# Altium schematic sheet iv_sensing.SchDoc: Triumvi - I/V Sensing
size Letter; Author: Ye-Sheng Kuo; Revision: 12; SheetNumber: 4; SheetTotal: 9
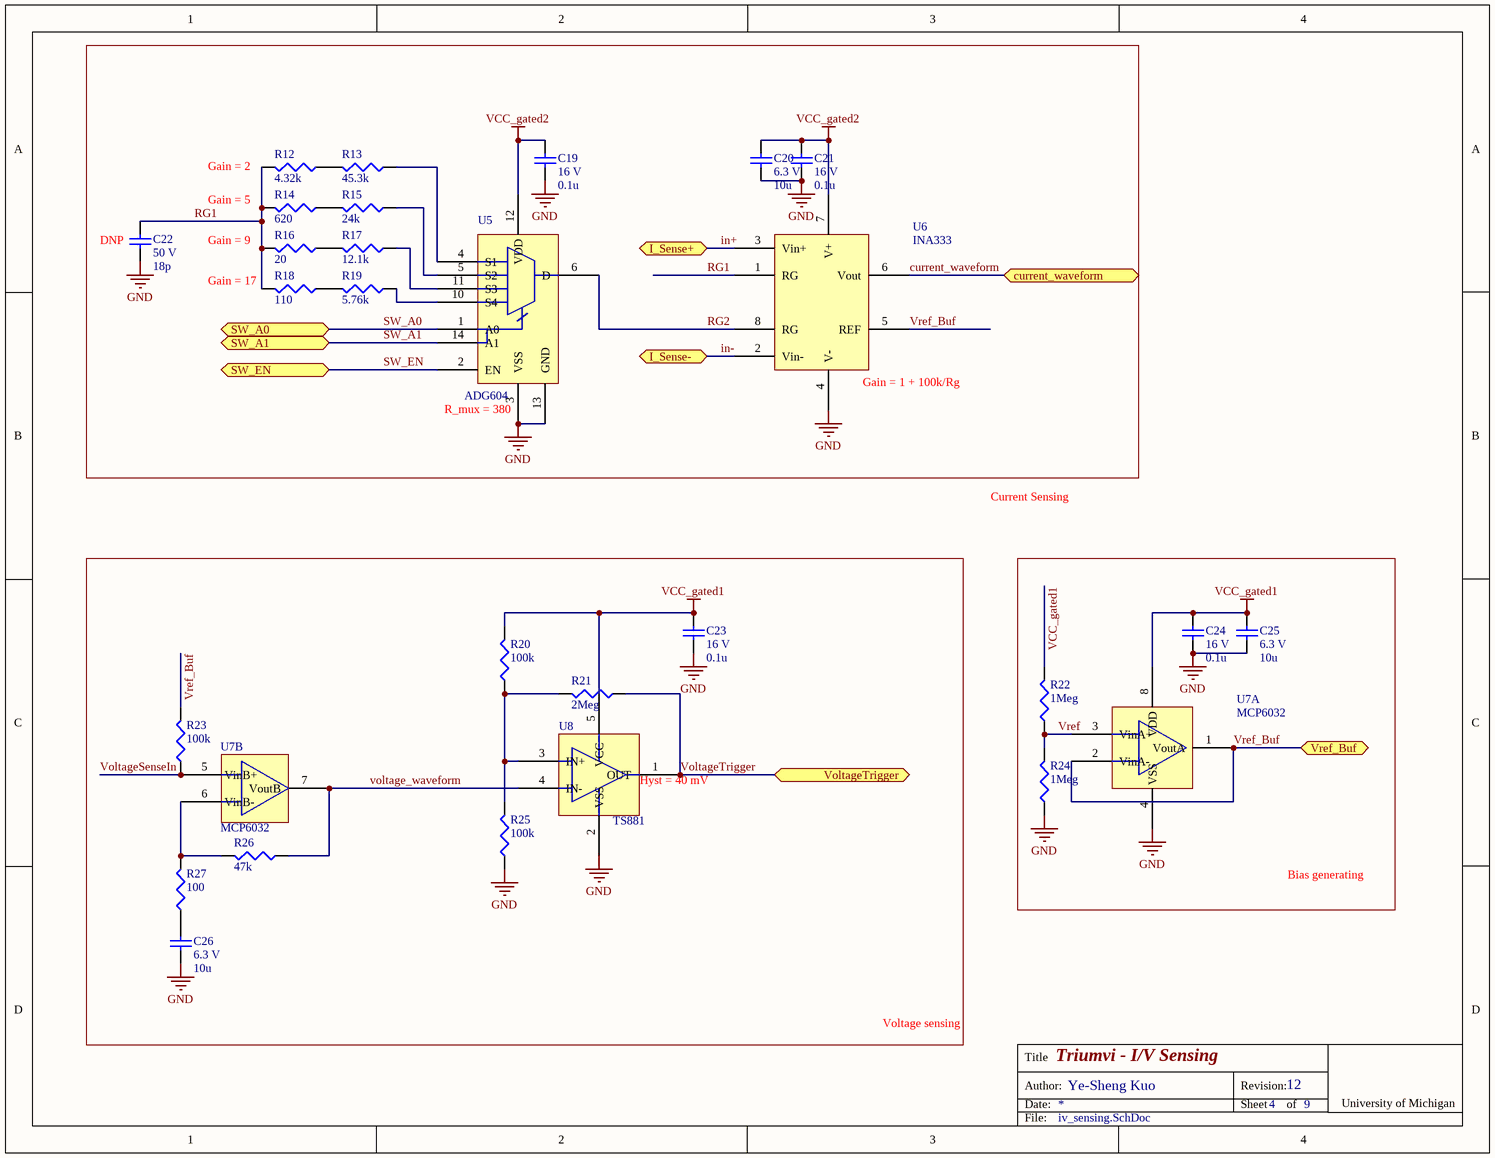
[diagram p0: iv_sensing.SchDoc]

## Parts
C19  voltage rated: 16 V  [0402]  (hidden comment: 0.1u)
C20  voltage rated: 6.3 V  [0603]  (hidden comment: 10u)
C21  voltage rated: 16 V  [0402]  (hidden comment: 0.1u)
C22  voltage rated: 50 V  [0402]  (hidden comment: 18p)
C23  voltage rated: 16 V  [0402]  (hidden comment: 0.1u)
C24  voltage rated: 16 V  [0402]  (hidden comment: 0.1u)
C25  voltage rated: 6.3 V  [0603]  (hidden comment: 10u)
C26  voltage rated: 6.3 V  [0603]  (hidden comment: 10u)
R12  4.32k  [0402]
R13  45.3k  [0402]
R14  620  [0402]
R15  24k  [0402]
R16  20  [0402]
R17  12.1k  [0402]
R18  110  [0402]
R19  5.76k  [0402]
R20  100k  [0402]
R21  2Meg  [0402]
R22  1Meg  [0402]
R23  100k  [0402]
R24  1Meg  [0402]
R25  100k  [0402]
R26  47k  [0402]
R27  100  [0402]
U5  ADG604  [TSSOP-14]
U6  INA333  [MSOP-8]
U7  MCP6032  [MSOP-8]  (parts A,B of 2)
U8  TS881  [SC70-5]

## Blocks framed on the sheet
Bias generating: C24 C25 R22 R24 U7

## Ports
current_waveform, I_Sense+, I_Sense-, SW_A0, SW_A1, SW_EN, VoltageTrigger, Vref_Buf

## Nets
GND: C19.2 C20.2 C21.2 C22.2 C23.2 C24.2 C25.2 C26.2 R24.2 R25.2 U5.3(VSS) U5.13(GND) U6.4(V-) U7.4(VSS) U8.2(VSS)
VCC_gated1: C23.1 C24.1 C25.1 R20.1 R22.1 U7.8(VDD) U8.5(VCC)
VCC_gated2: C19.1 C20.1 C21.1 U5.12(VDD) U6.7(V+)
current_waveform: U6.6(Vout) ; port current_waveform
in+: U6.3(Vin+) ; port I_Sense+
in-: U6.2(Vin-) ; port I_Sense-
RG1: C22.1 R12.1 R14.1 R16.1 R18.1 U6.1(RG)
RG2: U5.6(D) U6.8(RG)
SW_A0: U5.1(A0) ; port SW_A0
SW_A1: U5.14(A1) ; port SW_A1
SW_EN: U5.2(EN) ; port SW_EN
voltage_waveform: R26.2 U7.7(VoutB) U8.4(IN-)
VoltageSenseIn: R23.2 U7.5(VinB+)
VoltageTrigger: R21.2 U8.1(OUT) ; port VoltageTrigger
Vref: R22.2 R24.1 U7.3(VinA+)
Vref_Buf: R23.1 U6.5(REF) U7.1(VoutA) U7.2(VinA-) ; port Vref_Buf
NetC26_1: C26.1 R27.2
NetR12_2: R12.2 R13.1
NetR13_2: R13.2 U5.4(S1)
NetR14_2: R14.2 R15.1
NetR15_2: R15.2 U5.5(S2)
NetR16_2: R16.2 R17.1
NetR17_2: R17.2 U5.11(S3)
NetR18_2: R18.2 R19.1
NetR19_2: R19.2 U5.10(S4)
NetR20_2: R20.2 R21.1 R25.1 U8.3(IN+)
NetR26_1: R26.1 R27.1 U7.6(VinB-)

## Notes on the sheet
- (near R12) Gain = 2
- (near R14) Gain = 5
- (near C22) DNP
- (near R16) Gain = 9
- (near R18) Gain = 17
- (near U5) R_mux = 380
- (near U6) Gain = 1 + 100k/Rg
- Current Sensing
- (near U8) Hyst = 40 mV
- Voltage sensing
- Title
- Date:
- Author:
- Revision:
- Sheet
- of
- University of Michigan
- File:

## Library data of the parts
C19 C21 C23 C24 = GRM155R71C104KA88D: 0.10µF ±10% 16V Ceramic Capacitor X7R 0402; Manufacture: Murata; tolerance: 10%; package: 0402; Supplier 1: Digi-Key; Supplier Part Number 1: 490-3261-1-ND; Value: 0.1u; Temperature Coefficient: X7R; Manufacturer Part Number: GRM155R71C104KA88D
C20 C25 C26 = C1608X5R0J106M080AB: 10µF ±20% 6.3V Ceramic Capacitor X5R 0603; Manufacture: TDK; tolerance: 20%; package: 0603; Supplier 1: Digi-Key; Supplier Part Number 1: 445-4112-1-ND; Value: 10u; Temperature Coefficient: X5R; Manufacturer Part Number: C1608X5R0J106M080AB
C22 = 500R07S180GV4T: 18pF ±2% 50V Ceramic Capacitor C0G, NP0 0402; Manufacture: Johanson Technology Inc.; Note: DNP; tolerance: 2%; package: 0402; Temperature Coefficient: C0G, NP0; Manufacturer Part Number: 500R07S180GV4T; Supplier 1: Digi-Key; Supplier Part Number 1: 712-1264-1-ND; Value: 18p
R12 = CRCW04024K32FKED: RES SMD 4.32K OHM 1% 1/16W 0402; Manufacturer: Vishay Dale; Temperature Coefficient: 100 ppm/C; package: 0402; Manufacturer Part Number: CRCW04024K32FKED; Power: 1/16 W; Tolerance: 1%; Supplier 1: Digi-Key; Supplier Part Number 1: 541-4.32KLCT-ND; value: 4.32k
R13 = RT0402DRD0745K3L: RES SMD 45.3KOHM 0.5% 1/16W 0402; Manufacturer: Yageo; Temperature Coefficient: 25 ppm/C; package: 0402; Manufacturer Part Number: RT0402DRD0745K3L; Power: 1/16 W; Tolerance: 0.5%; Supplier 1: Digi-Key; Supplier Part Number 1: YAG4430CT-ND; value: 45.3k
R14 = CRCW0402620RFKED: RES SMD 620 OHM 1% 1/16W 0402; Manufacturer: Vishay Dale; Temperature Coefficient: 100 ppm/C; package: 0402; Manufacturer Part Number: CRCW0402620RFKED; Power: 1/16 W; Tolerance: 1%; Supplier 1: Digi-Key; Supplier Part Number 1: 541-620LCT-ND; value: 620
R15 = RT0402DRE0724KL: RES SMD 24K OHM 0.5% 1/16W 0402; Manufacturer: Yageo; Temperature Coefficient: 50 ppm/C; package: 0402; Manufacturer Part Number: RT0402DRE0724KL; Power: 1/16 W; Tolerance: 0.5%; Supplier 1: Digi-Key; Supplier Part Number 1: 311-2260-1-ND; value: 24k
R16 = CRCW040220R0FKED: RES SMD 20 OHM 1% 1/16W 0402; Manufacturer: Vishay Dale; Temperature Coefficient: 100 ppm/C; package: 0402; Manufacturer Part Number: CRCW040220R0FKED; Power: 1/16 W; Tolerance: 1%; Supplier 1: Digi-Key; Supplier Part Number 1: 541-20.0LCT-ND; value: 20
R17 = CRCW040212K1FKED: RES SMD 12.1K OHM 1% 1/16W 0402; Manufacturer: Vishay Dale; Temperature Coefficient: 100 ppm/C; package: 0402; Manufacturer Part Number: CRCW040212K1FKED; Power: 1/16 W; Tolerance: 1%; Supplier 1: Digi-Key; Supplier Part Number 1: 541-12.1KLCT-ND; value: 12.1k
R18 = CRCW0402110RFKED: RES SMD 110 OHM 1% 1/16W 0402; Manufacturer: Vishay Dale; Temperature Coefficient: 100 ppm/C; package: 0402; Manufacturer Part Number: CRCW0402110RFKED; Power: 1/16 W; Tolerance: 1%; Supplier 1: Digi-Key; Supplier Part Number 1: 541-110LCT-ND; value: 110
R19 = RC0402FR-075K76L: RES SMD 5.76K OHM 0.5% 1/16W 0402; Manufacturer: Yageo; Temperature Coefficient: 100 ppm/C; Tolerance: 1%; package: 0402; Manufacturer Part Number: RC0402FR-075K76L; Power: 1/16 W; Supplier 1: Digi-Key; Supplier Part Number 1: YAG3196CT-ND; value: 5.76k
R20 R23 R25 = CRCW0402100KFKED: RES SMD 100K OHM 1% 1/16W 0402; Manufacturer: Vishay Dale; Temperature Coefficient: 100 ppm/C; Tolerance: 1%; Power: 1/16 W; Supplier 1: Digi-Key; Supplier Part Number 1: 541-100KLCT-ND; package: 0402; value: 100k; Manufacturer Part Number: CRCW0402100KFKED
R21 = CRCW04022M00FKED: RES SMD 2M OHM 1% 1/16W 0402; Manufacturer: Vishay Dale; Temperature Coefficient: 100 ppm/C; Tolerance: 1%; Power: 1/16 W; package: 0402; Supplier 1: Digi-Key; Supplier Part Number 1: 541-2.00MLCT-ND; value: 2Meg; Manufacturer Part Number: CRCW04022M00FKED
R22 R24 = CRCW04021M00FKED: RES SMD 1M OHM 1% 1/16W 0402; Manufacturer: Vishay Dale; Temperature Coefficient: 100 ppm/C; Tolerance: 1%; Power: 1/16 W; Supplier 1: Digi-Key; Supplier Part Number 1: 541-1.00MLCT-ND; package: 0402; value: 1Meg; Manufacturer Part Number: CRCW04021M00FKED
R26 = CRCW040247K0FKED: RES SMD 47K OHM 1% 1/16W 0402; Manufacturer: Vishay Dale; Temperature Coefficient: 100 ppm/C; Tolerance: 1%; Power: 1/16 W; package: 0402; Supplier 1: Digi-Key; Supplier Part Number 1: 541-47.0KLCT-ND; value: 47k; Manufacturer Part Number: CRCW040247K0FKED
R27 = CRCW0402100RFKED: RES SMD 100 OHM 1% 1/16W 0402; Manufacturer: Vishay Dale; Temperature Coefficient: 100 ppm/C; Tolerance: 1%; Power: 1/16 W; package: 0402; Supplier 1: Digi-Key; Supplier Part Number 1: 541-100LCT-ND; value: 100; Manufacturer Part Number: CRCW0402100RFKED
U5 = ADG604: 1 pC Charge Injection, 100 pA Leakage  CMOS  5 V/5 V/3 V 4-Channel Multiplexer; Supplier 1: Digi-Key; Supplier Part Number 1: ADG604YRUZ-ND
U6 = INA333: Micro-Power (50uA), Zero-Drift, Rail-to-Rail Out  Instrumentation Amplifier; Supplier 1: Digi-Key; Supplier Part Number 1: 296-23564-1-ND
U7 = MCP6032: 0.9 µA, High Precision Op Amps; Supplier 1: Digi-Key; Supplier Part Number 1: MCP6032-E/MS-ND
U8 = TS881: Rail-to-rail 0.9 V nanopower comparator; Supplier 1: Digi-Key; Supplier Part Number 1: 497-13217-1-ND